# EAGLE design LipSync_Main_Board (EAGLE 9.5.2)
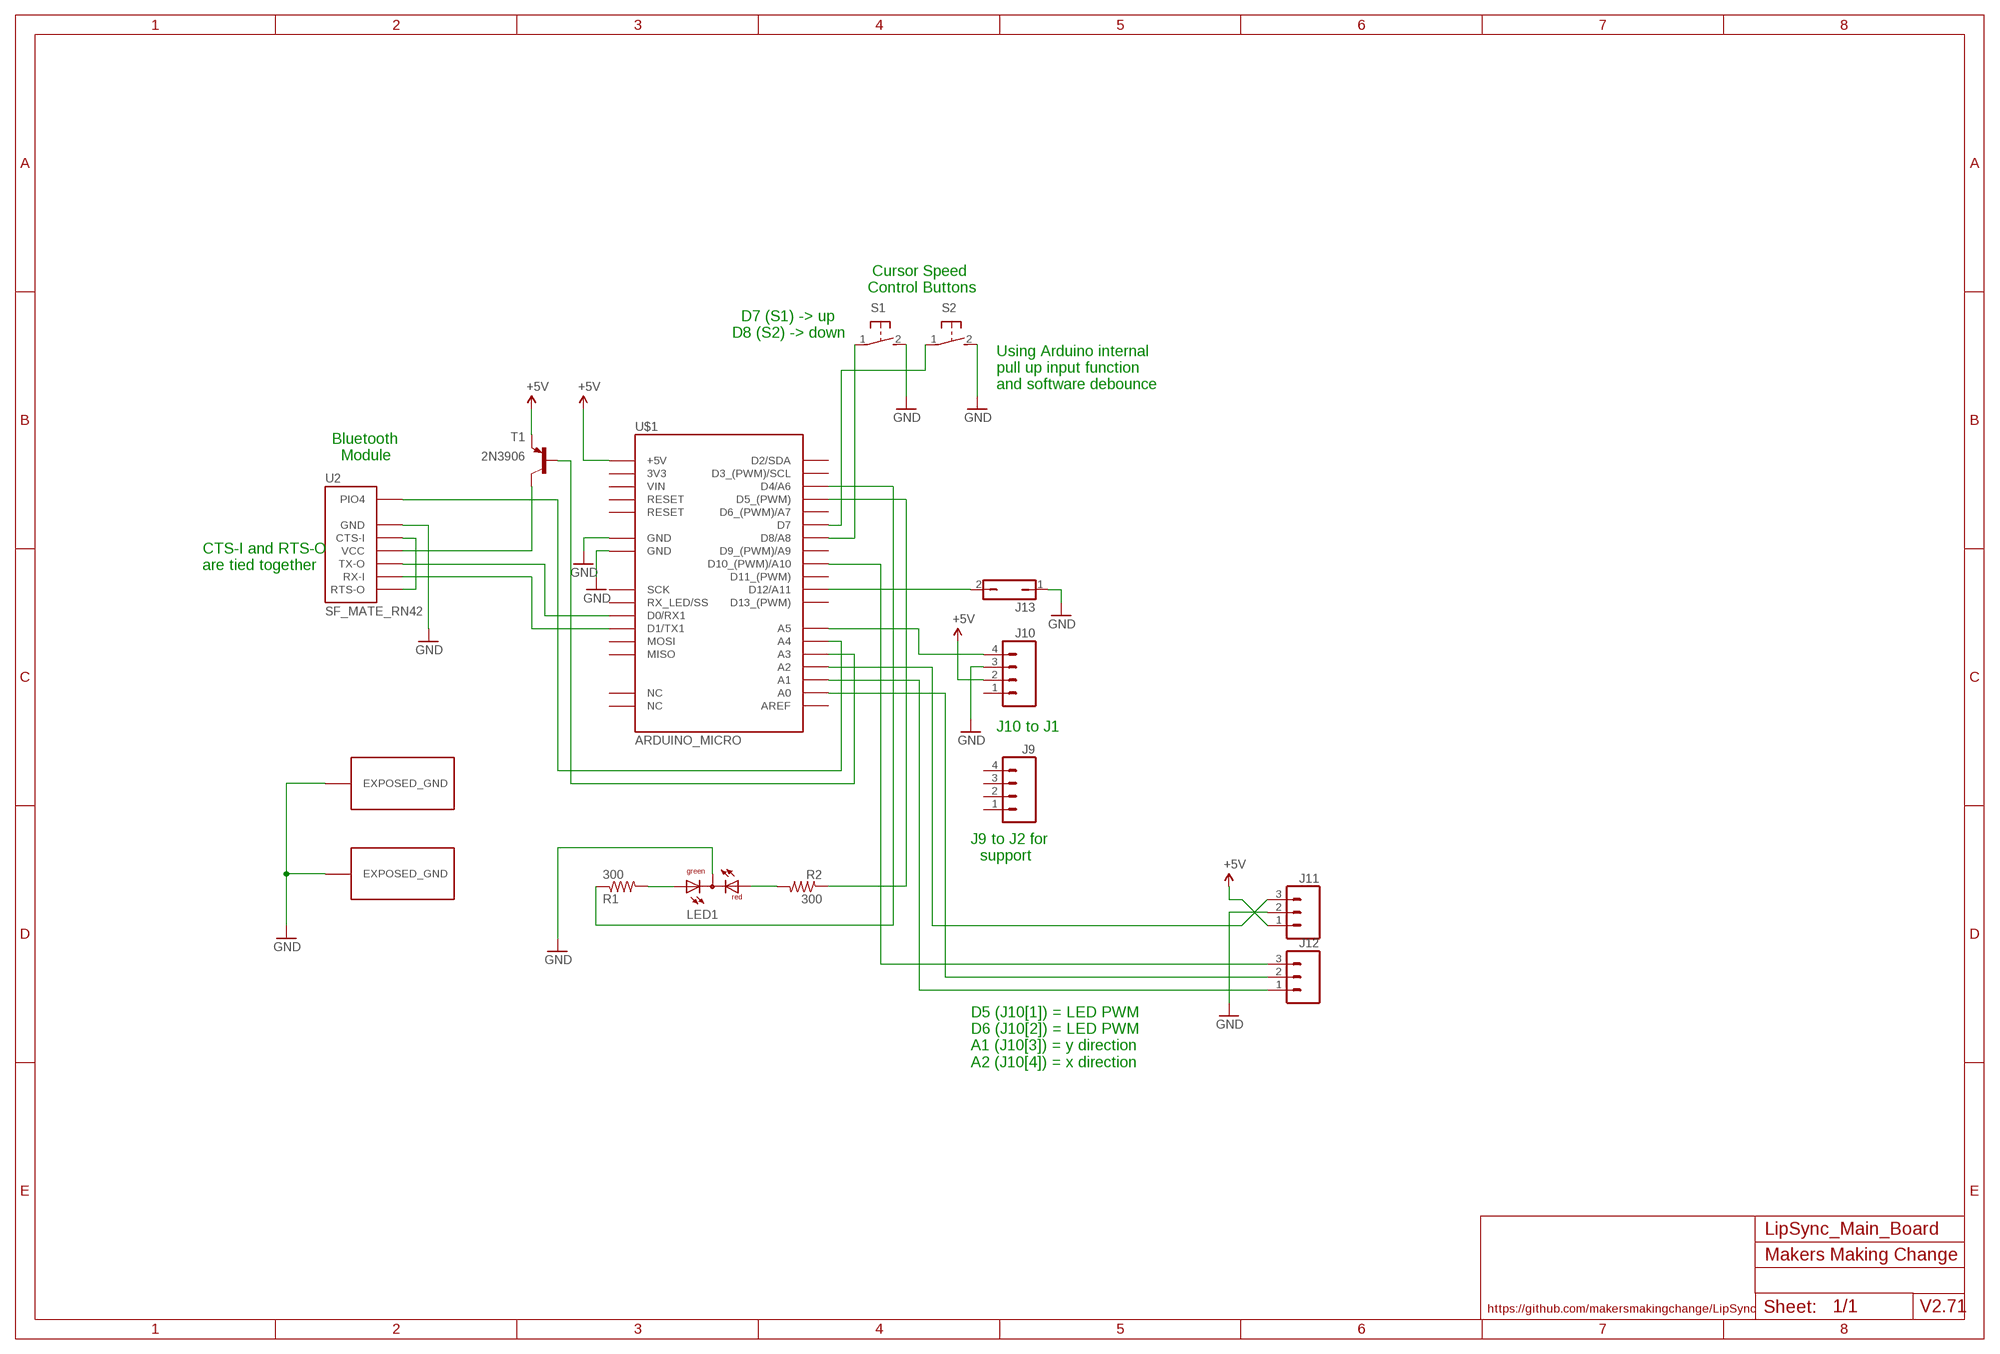
[diagram p0: schematic, sheet 1]

## Parts
J9  M04PTH  [1X04]
J10  M04PTH  [1X04]
J11  M03LOCK  [1X03_LOCK]
J12  M03LOCK  [1X03_LOCK]
J13  JP1Q  [JP1]
LED1  DUOLED-RG-C  [DUOLED-C-5MM]
R1  300  RESISTORAXIAL-0.3  [AXIAL-0.3]
R2  300  RESISTORAXIAL-0.3  [AXIAL-0.3]
S1  31-XXB3F-31XX-CUSTOM  [B3F-31XX-CUSTOM]
S2  31-XXB3F-31XX-CUSTOM  [B3F-31XX-CUSTOM]
T1  2N3906  2N3906-PNP-TO92-EBC  [TO92-EBC]
U2  SF_MATE_RN42  [BLUE_MATE_RN42_HEADER_FOOTPRINT]
U$1  ARDUINO_MICRO  [ARDUINO_MICRO_HEADER_FOOTPRINT]
U$2  EXPOSED_GND  [EXPOSED_GND]
U$3  EXPOSED_GND  [EXPOSED_GND]

## Nets
GND: J10.3 J11.2 J13.1 LED1.C S1.2(S) S2.2(S) U2.GND U$1.GND U$1.GND@1(GND) U$2.GND1(EXPOSED_GND) U$3.GND1(EXPOSED_GND)
N$1: U2.PIO4 U$1.A4
N$2: T1.C U2.VCC
N$3: U2.TX-O U$1.RX1(D0/RX1)
N$4: U2.RX-I U$1.TX1(D1/TX1)
N$5: J12.2 U$1.A0
N$6: J12.1 U$1.A1
N$9: U2.CTS-I U2.RTS-O
N$10: J12.3 U$1.D10(D10_(PWM)/A10)
N$11: J10.4 U$1.A5
N$12: LED1.AX(AG) R1.P$2
N$13: LED1.AR R2.P$2
N$14: S1.1(P) U$1.D8(D8/A8)
N$15: S2.1(P) U$1.D7
N$18: R1.P$1 U$1.D4(D4/A6)
N$19: R2.P$1 U$1.D5(D5_(PWM))
N$20: T1.B U$1.A3
N$21: J11.3 U$1.A2
N$23: J13.2 U$1.D12(D12/A11)
VCC: J10.2 J11.1 T1.E U$1.5V(+5V) ; supply symbol labelled +5V
Unconnected: J9.1 J9.2 J9.3 J9.4 J10.1 U$1.D2(D2/SDA) U$1.D3(D3_(PWM)/SCL) U$1.D6(D6_(PWM)/A7) U$1.D9(D9_(PWM)/A9) U$1.D11(D11_(PWM)) U$1.D13(D13_(PWM)) U$1.MISO U$1.MOSI U$1.NC U$1.NC@1(NC) U$1.REF(AREF) U$1.RST(RESET) U$1.RST@1(RESET) U$1.SCK U$1.SS(RX_LED/SS) U$1.VIN

## Notes on the sheet
- Cursor Speed
  Control Buttons
- D7 (S1) -> up
  D8 (S2) -> down
- Using Arduino internal
  pull up input function
  and software debounce
- Bluetooth
    Module
- CTS-I and RTS-O 
  are tied together
- J10 to J1
- J9 to J2 for
    support
- D5 (J10[1]) = LED PWM
  D6 (J10[2]) = LED PWM
  A1 (J10[3]) = y direction
  A2 (J10[4]) = x direction
- Makers Making Change
- https://github.com/makersmakingchange/LipSync | V2.71

## Power pins joined to a net without a drawn wire
3V3: U$1.3V3

## Library data of the parts
J9 J10 = SparkFun-Connectors:M04: Header 4 Standard 4-pin 0.1" header. Use with straight break away headers (SKU : PRT-00116), right angle break away headers (PRT-00553), swiss pins (PRT-00743), machine pins (PRT-00117), and female headers (PRT-00115). Molex polarized connector foot print use with SKU : PRT-08231 with associated crimp pins and housings. 1MM SMD Version SKU: PRT-10208; PROD_ID: CONN-09696
J11 J12 = SparkFun-Connectors:M03: Header 3 Standard 3-pin 0.1" header. Use with straight break away headers (SKU : PRT-00116), right angle break away headers (PRT-00553), swiss pins (PRT-00743), machine pins (PRT-00117), and female headers (PRT-00115). Molex polarized connector foot print use with SKU : PRT-08232 with associated crimp pins and housings.
J13 = jumper:JP1Q: JUMPER
LED1 = led:DUOLED-RG-C: DUO LED 2 colors (red/green), 5 mm, round, common Cathode www.ligitek.com or other producers.
R1 R2 = SparkFun-Passives:RESISTOR: Resistor Basic schematic elements and footprints for 0603, 1206, and PTH resistors.
S1 S2 = switch-omron:31-XX: OMRON SWITCH
T1 = transistor-neu-to92:*-PNP-: PNP Transistror
U2 = IVAN_custom:SF_MATE_RN42: BlueSMiRF Silver Bluetooth Modem produced by SparkFun. This module uses the Bluetooth RN42 module. More information: SparkFun BlueSMiRF - Silver <https://www.sparkfun.com/products/12582> and Microchip RN42 <http://www.microchip.com/wwwproducts/en/RN42>
U$1 = IVAN_custom:ARDUINO_MICRO: Arduino Micro created through the collaboration of Arduino and Adafruit. The digital pins appropriately listed can output PWM and input analog as well as digital signals. Further information: Arduino Micro <https://www.arduino.cc/en/Main/ArduinoBoardMicro>
U$2 U$3 = IVAN_custom:EXPOSED_GND: Exposed copper plane to connect ground to conductive ABS housing

## Net classes
0 GND: clearance 0.205 mm
2 GND2: clearance 0.205 mm to class 0, clearance 0.205 mm to class 1, clearance 0.205 mm
3 GND3: clearance 0.205 mm to class 0, clearance 0.205 mm to class 1, clearance 0.205 mm to class 2, clearance 0.205 mm

## Board
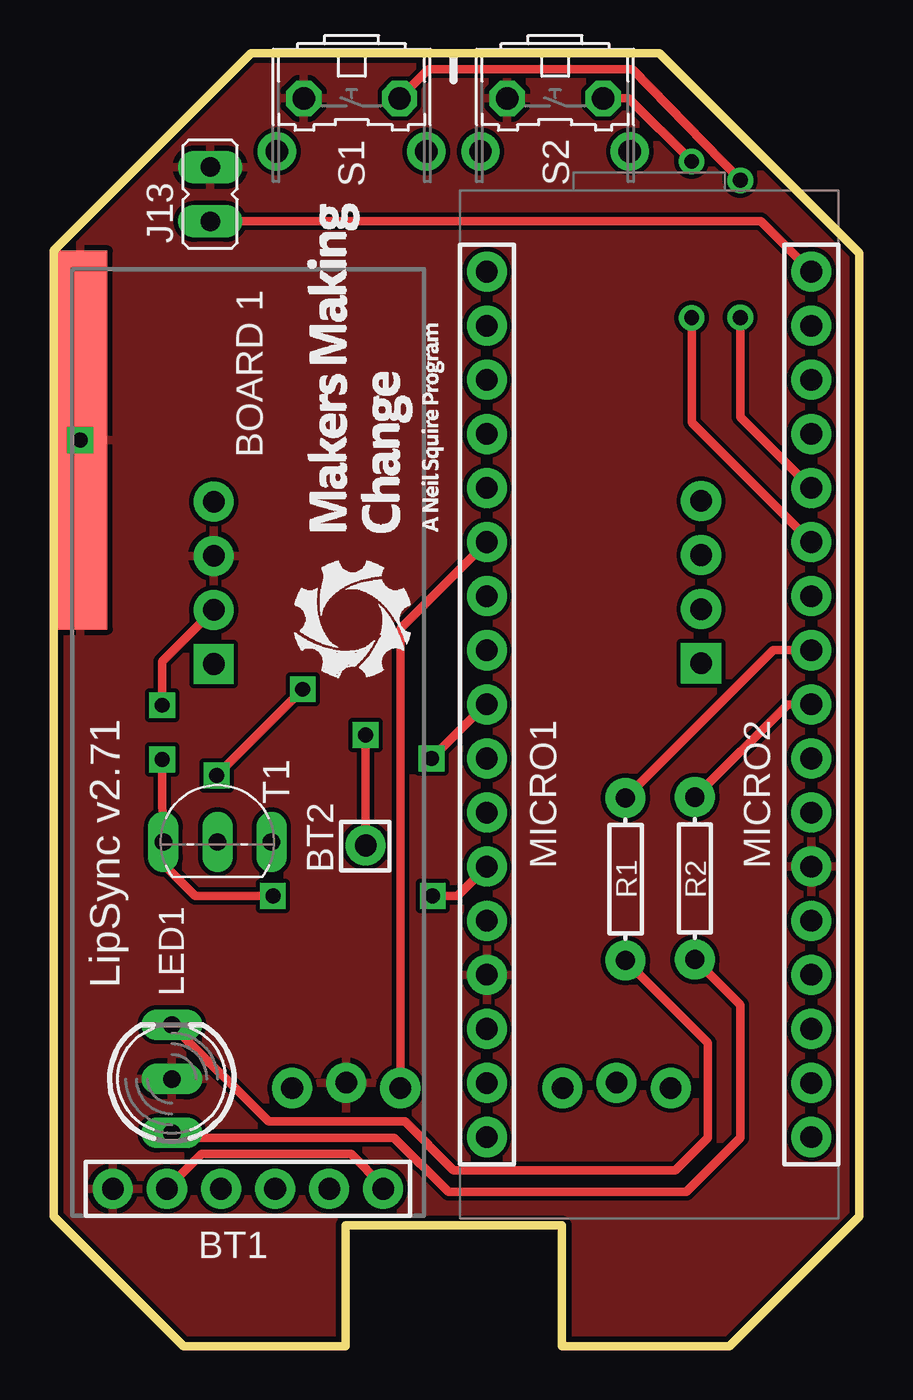
[diagram p1: board, top side]
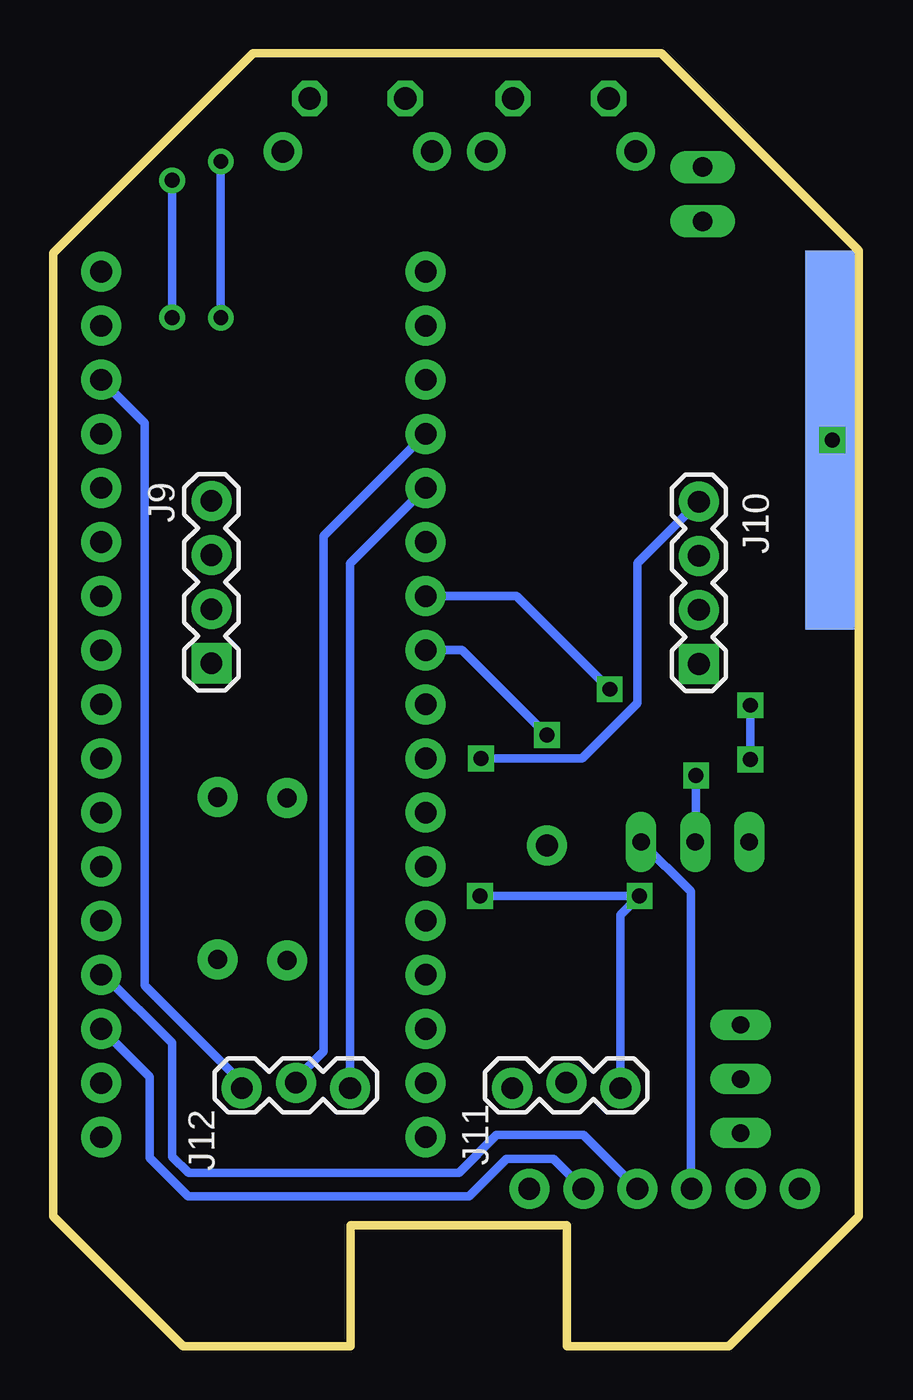
[diagram p2: board, bottom side, seen from below]

Size 37.85 x 60.72 mm. Coordinates in mm from the lower left corner, seen from the top.
Outline: 37.85,6.11 37.85,51.32 28.45,60.72 9.27,60.72 0,51.45 0,6.11 6.11,0 13.72,0 13.72,5.67 23.88,5.67 23.88,0 31.74,0 37.85,6.11
Copper layers (1*16): Top 0.035mm / dielectric 1.5mm / Bottom 0.035mm
Design rules "SparkFun": minimum track width 8mil, minimum drill 20mil, track to track 8mil, track to pad 8mil, pad to pad 8mil, via to via 8mil, smd to smd 8mil, copper to edge 10mil, drill to drill 8mil, minimum pad ring 12mil, minimum via ring 10mil, stop-mask expansion 4mil, vias tented up to drill 25mil, thermal gap 10mil

### Footprints (pad centres in the part's own frame; a part is rotated, then mirrored left to right if it is on the bottom)
1X04 = drill 1.016 pad 1.88 square: 1 0,0 | drill 1.016 pad 1.88: 2 2.54,0; 3 5.08,0; 4 7.62,0
1X03_LOCK = drill 1.016 pad 1.88: 1 0,0.127; 2 2.54,-0.127; 3 5.08,0.127
JP1 = drill 0.914 long: 1 0,-1.27; 2 0,1.27
DUOLED-C-5MM = drill 0.813 long: AR 2.54,0; AX -2.54,0; C 0,0
AXIAL-0.3 = drill 0.9 pad 1.88: P$1 -3.81,0; P$2 3.81,0
B3F-31XX-CUSTOM = drill 1.05 pad 1.6 octagon: 1 -2.25,-1.245; 2 2.25,-1.245 | drill 1.05 pad 1.8: 3 -3.505,1.245; 4 3.505,1.245
TO92-EBC = drill 0.813 long: B 0,-1.27; C 2.54,-1.27; E -2.54,-1.27
BLUE_MATE_RN42_HEADER_FOOTPRINT = drill 1.016 pad 1.88: CTS-I 1.27,12.065; GND 1.27,14.605; PIO4 17.399,2.731; RTS-O 1.27,1.905; RX-I 1.27,4.445; TX-O 1.27,6.985; VCC 1.27,9.525
ARDUINO_MICRO_HEADER_FOOTPRINT = drill 1.016 pad 1.88: 3V3 16.51,6.35; 5V 16.51,31.75; A0 16.51,11.43; A1 16.51,13.97; A2 16.51,16.51; A3 16.51,19.05; A4 16.51,21.59; A5 16.51,24.13; D2 1.27,29.21; D3 1.27,26.67; D4 1.27,24.13; D5 1.27,21.59; D6 1.27,19.05; D7 1.27,16.51; D8 1.27,13.97; D9 1.27,11.43; D10 1.27,8.89; D11 1.27,6.35; D12 1.27,3.81; D13 16.51,3.81; GND 1.27,31.75; GND@1 16.51,36.83; MISO 16.51,41.91; MOSI 1.27,44.45; NC 16.51,26.67; NC@1 16.51,29.21; REF 16.51,8.89; RST 1.27,34.29; RST@1 16.51,34.29; RX1 1.27,36.83; SCK 16.51,44.45; SS 1.27,41.91; TX1 1.27,39.37; VIN 16.51,39.37
EXPOSED_GND = smd 2.54 x 17.78: GND1 0,0

### Placement (x,y rotation side)
J9  30.42,32.07 90 bottom
J10  7.52,32.04 90 bottom
J11  11.21,12.25 180 bottom
J12  23.91,12.25 180 bottom
J13  7.36,54.1 180 top
LED1  5.56,12.55 90 top
R1  30.12,21.97 270 top
R2  26.87,21.93 270 top
S1  14,57.35 180 top
S2  23.56,57.35 180 top
T1  7.7,24.95 0 top
U2  17.39,6.12 90 top
U$1  36.86,54.27 180 top
U$2  1.26,42.55 0 top
U$3  1.26,42.55 0 bottom

### Tracks (layer width: path | path; a pad name or v marks a point on that pad's centre or on a via)
GND  (via drill 0.7)
  other vias: 1.26,42.55
  pour Top: 0,51.45 9.27,60.72 28.45,60.72 37.85,51.32 37.85,6.11 31.75,0 6.1,0 0,6.11
N$1  (via drill 0.7)
  Top 0.406: v14.66,28.7 14.66,23.67 U2.PIO4
  Bottom 0.406: U$1.A4 18.64,32.68 v14.66,28.7
N$2
  Bottom 0.406: T1.C 7.91,21.35 7.91,7.39 U2.VCC
N$3
  Bottom 0.406: U$1.RX1 35.47,17.44 32.26,14.24 32.26,8.9 31.5,8.14 18.8,8.14 17.02,9.92 12.93,9.92 U2.TX-O
N$4
  Bottom 0.406: U2.RX-I 14.35,8.8 16.56,8.8 18.31,7.05 31.51,7.05 33.31,8.85 33.31,12.65 35.56,14.9 U$1.TX1
N$5
  Bottom 0.406: U$1.A0 25.15,38.05 25.15,13.86 26.45,12.55 J12.2
N$6
  Bottom 0.406: U$1.A1 23.91,36.75 J12.1
N$9
  Top 0.406: U2.CTS-I 6.96,9.03 13.97,9.03 15.49,7.51 U2.RTS-O
N$10
  Bottom 0.406: U$1.D10 33.56,43.35 33.56,16.95 28.99,12.38 J12.3
N$11  (via drill 0.7)
  Top 0.406: U$1.A5 20.3,30.14 v17.76,27.6
  Bottom 0.406: v17.76,27.6 13.01,27.6 10.41,30.2 10.41,36.77 J10.4
N$12
  Top 0.406: R1.P$2 32.26,16.03 32.26,9.79 29.72,7.25 18.54,7.25 16,9.79 5.78,9.79 LED1.AX
N$13
  Top 0.406: R2.P$2 30.73,14.26 30.73,9.79 29.21,8.27 18.8,8.27 16.51,10.55 10.1,10.55 LED1.AR
N$14  (via drill 0.7 pad 1.02)
  Top 0.406: S1.1 17.62,59.96 27.18,59.96 v32.26,54.75 | v32.26,48.31 32.26,43.64 U$1.D8
  Bottom 0.406: v32.26,54.75 v32.26,48.31
N$15  (via drill 0.7 pad 1.02)
  Top 0.406: S2.1 27.01,58.6 v29.97,55.64 | v29.97,48.29 29.97,43.38 U$1.D7
  Bottom 0.406: v29.97,55.64 v29.97,48.29
N$18
  Top 0.406: R1.P$1 34.48,30.14 U$1.D4
N$19
  Top 0.406: R2.P$1 33.81,32.68 U$1.D5
N$20  (via drill 0.7)
  Top 0.406: v11.71,30.85 v7.66,26.8
  Bottom 0.406: U$1.A3 16.08,35.22 v11.71,30.85 | v7.66,26.8 7.66,23.72 T1.B
N$21
  Top 0.406: J11.3 16.29,33.7 U$1.A2
N$23
  Top 0.406: J13.2 33.22,52.83 U$1.D12
VCC  (via drill 0.7)
  Top 0.406: v10.31,21.15 6.66,21.15 5.16,22.65 T1.E 5.11,25.73 v5.11,27.55 | v5.11,30.1 5.11,32.16 J10.2 | v17.81,21.15 18.98,21.15 U$1.5V
  Bottom 0.406: v17.81,21.15 v10.31,21.15 11.21,20.25 J11.1 | v5.11,27.55 v5.11,30.1

### Text on the board
tNames: S1 | S2 | J13 | BOARD 1 | T1 | BT2 | MICRO1 | MICRO2 | R1 | R2 | LipSync v2.71 | LED1 | BT1
bNames: J9 | J10 | J11 | J12